# EasyEDA schematic SCH_task-L2.json
TITLE: Sheet_1; REV: 1.0; Date: 2022-07-27; Sheet: 1/1; Company: Your Company
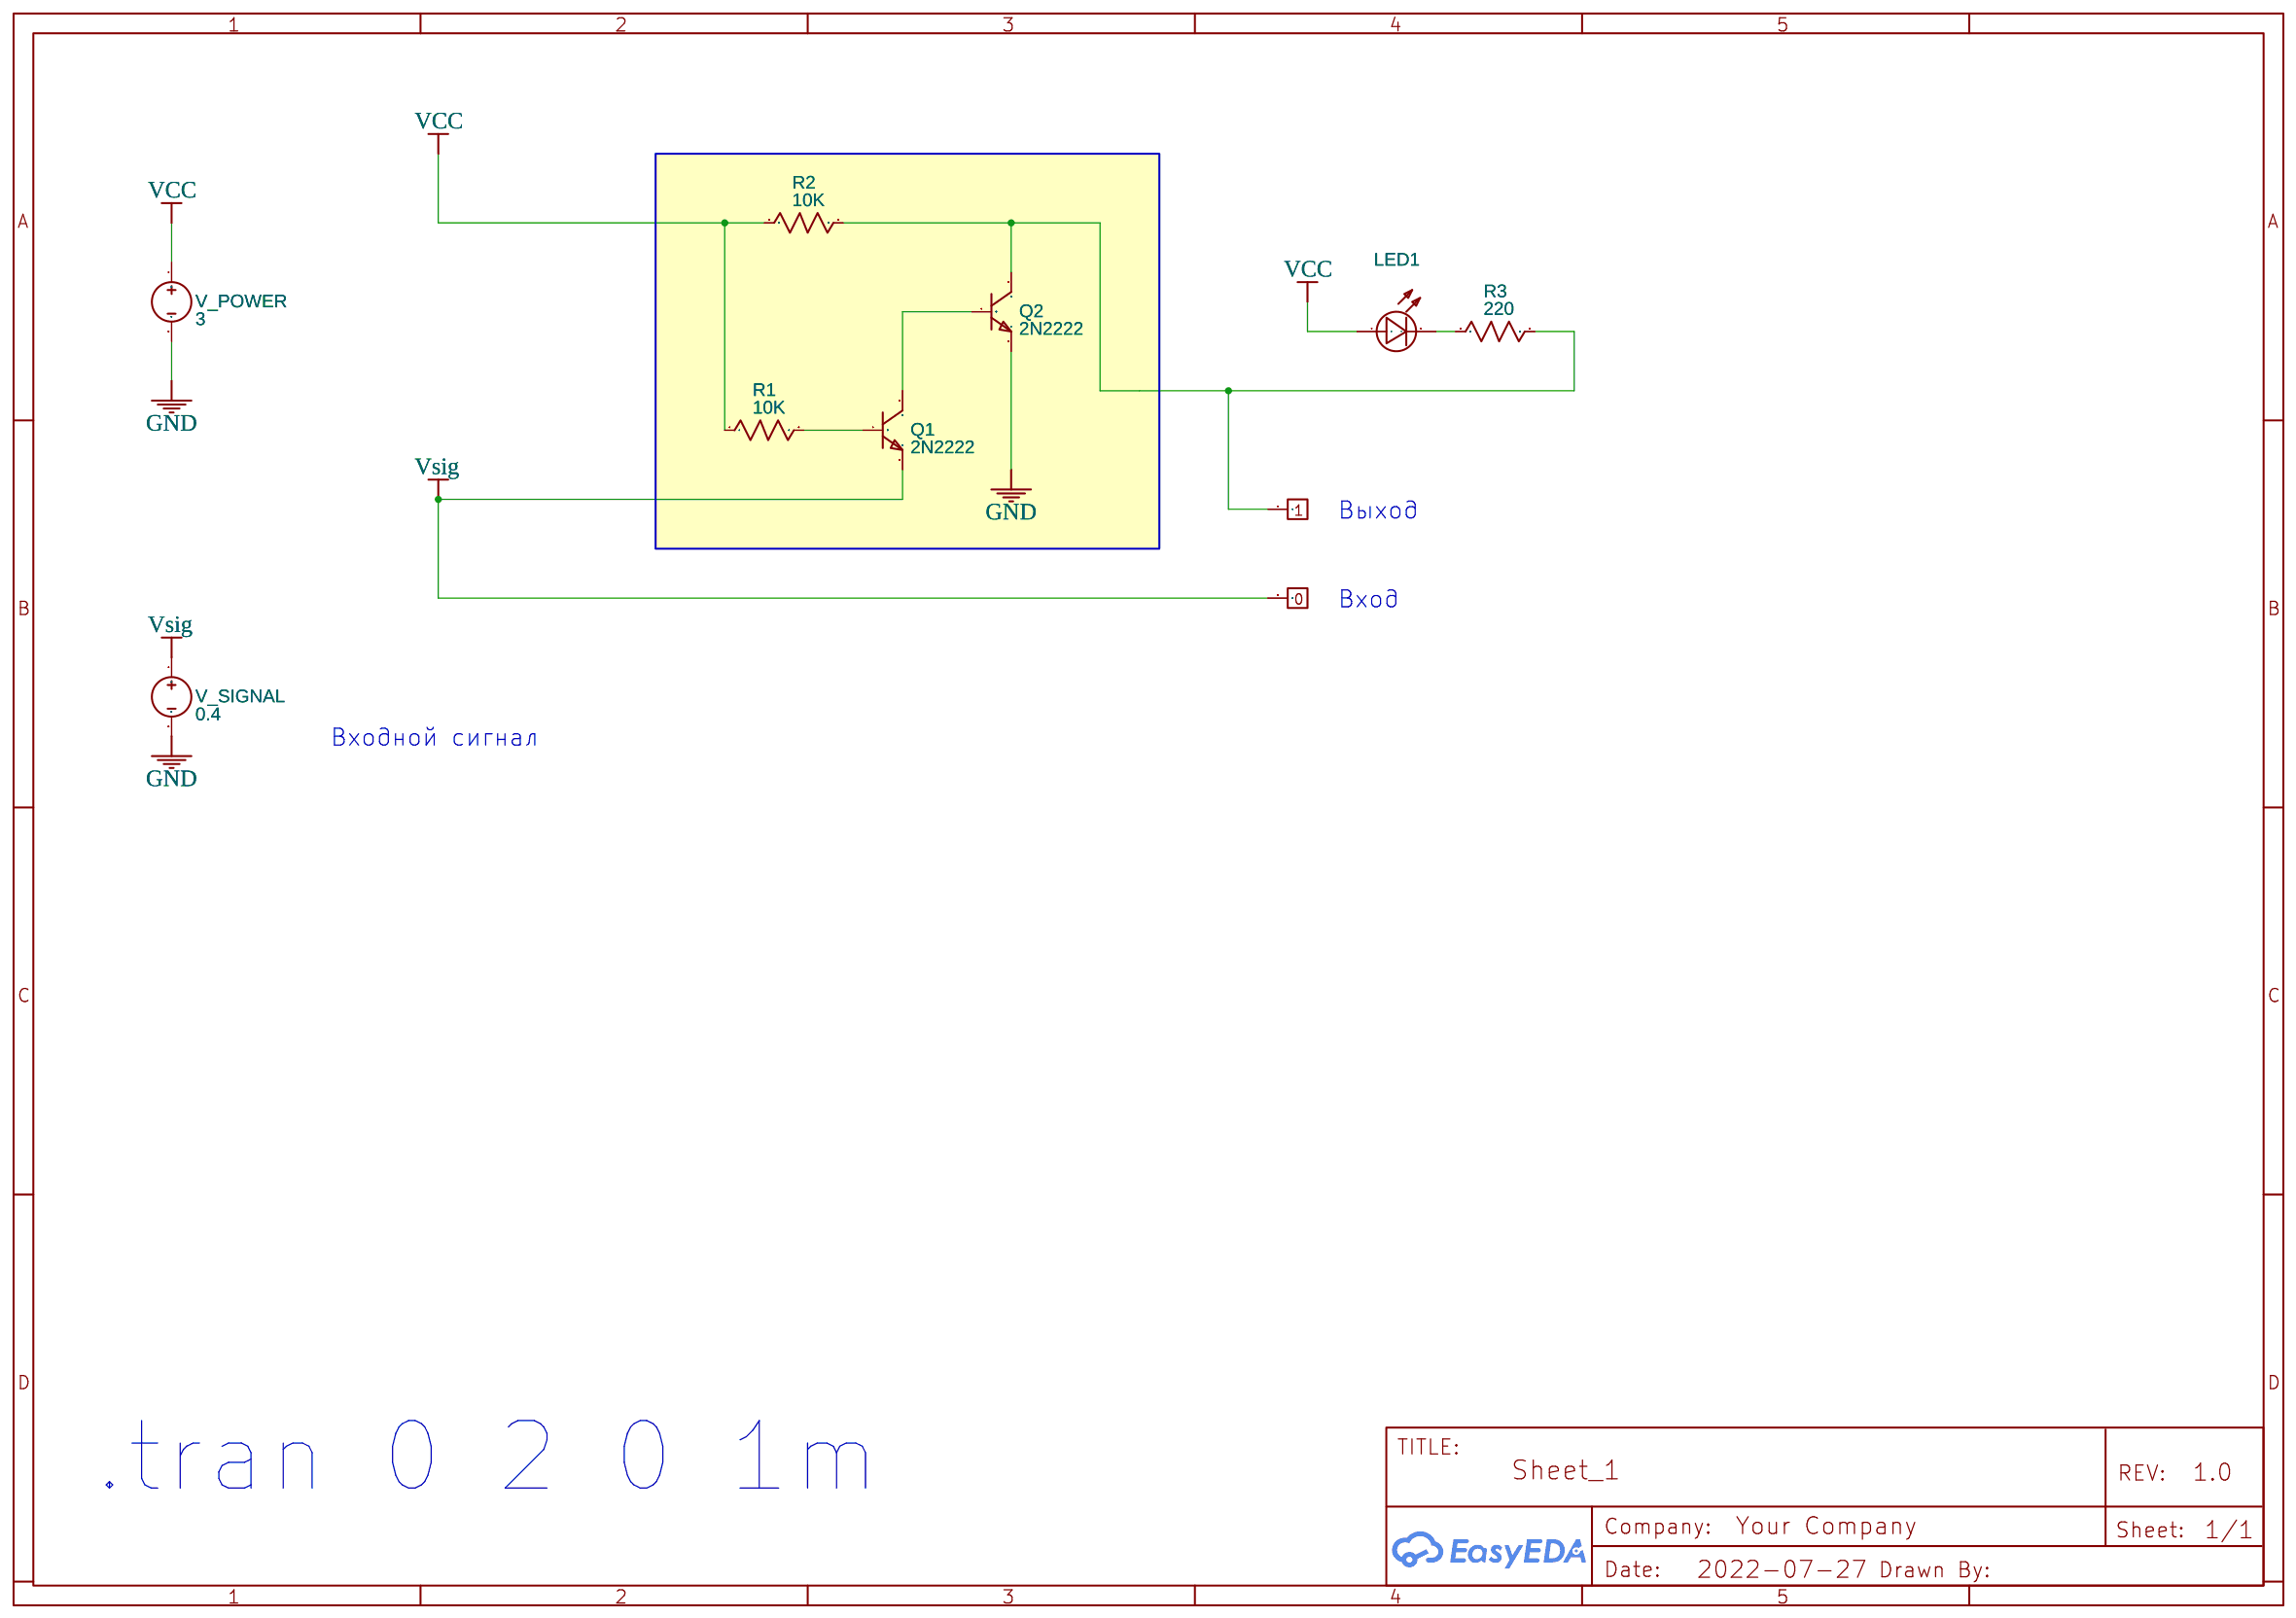
[diagram p0: schematic sheet]

## Parts
LED1  LED
Q1  2N2222
Q2  2N2222
R1  10K  [AXIAL-0.3]
R2  10K  [AXIAL-0.3]
R3  220  [AXIAL-0.3]
U1  Logic_Probe
U3  Logic_Probe
V_POWER  3  [HDR1X2]
V_SIGNAL  0.4  [HDR1X2]

## Library data of the parts
LED1 = LED: catid: 20; Contributor: 仿真库绘制; Color: Red; NameDisplay: 0
Q1 Q2 = 2N2222: Contributor: EasyEDA
R1-R3 = Resistor_US: Resistance: 1k; Contributor: EasyEDA; Supplier: YUJING
U1 U3 = LOGICPROBE: Contributor: EasyEDA; PreDisplay: 0; NameDisplay: 0; Voltage: 0
V_POWER V_SIGNAL = VDC: Contributor: EasyEDA; sim: true

## Nets
GND: Q2.2(E) V_POWER.2 V_SIGNAL.2
VCC: LED1.1(+) R1.1 R2.1 V_POWER.1
Vsig: Q1.2(E) U3.1 V_SIGNAL.1
Net-(LED1-2): LED1.2(-) R3.1
Net-(Q1-1): Q1.1(B) R1.2
Net-(Q1-3): Q1.3(C) Q2.1(B)
Net-(Q2-3): Q2.3(C) R2.2 R3.2 U1.1

## Notes on the sheet
- Выход
- Вход
- Входной сигнал
- .tran 0 2 0 1m
